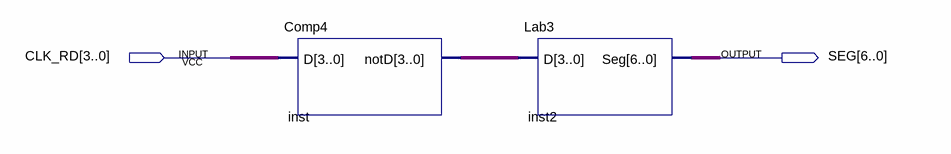
[diagram p0: schematic sheet]
// Quartus schematic CLKto7.bdf as structural Verilog: 2 symbols, 2 pins
module CLKto7 (
  input  [3:0] CLK_RD,
  output [6:0] SEG
);

  wire [3:0] inst_notd;

  Comp4 inst (.D(CLK_RD), .notD(inst_notd));
  Lab3 inst2 (.D(inst_notd), .Seg(SEG));
endmodule
